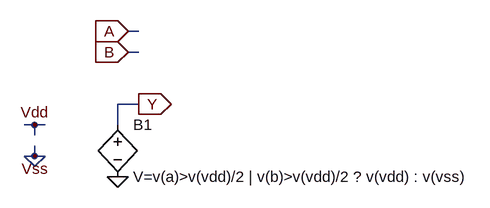
[diagram p0: schematic or.asc]
or.asc, the LTspice schematic file:
Version 4
SHEET 1 1284 680
WIRE 656 0 640 0
WIRE 656 32 640 32
WIRE 656 112 624 112
WIRE 496 144 480 144
WIRE 512 144 496 144
WIRE 624 144 624 112
WIRE 496 160 496 144
WIRE 496 192 496 176
WIRE 496 192 480 192
WIRE 512 192 496 192
WIRE 496 208 480 192
WIRE 496 208 512 192
FLAG 656 112 Y
IOPIN 656 112 Out
FLAG 624 224 0
FLAG 640 0 A
IOPIN 640 0 In
FLAG 640 32 B
IOPIN 640 32 In
FLAG 496 144 Vdd
FLAG 496 192 Vss
SYMBOL bv 624 128 R0
SYMATTR InstName B1
SYMATTR Value V=v(a)>v(vdd)/2 | v(b)>v(vdd)/2 ? v(vdd) : v(vss)

The netlist it stands for:
* or.asc
B1 Y 0 V=v(a)>v(vdd)/2 | v(b)>v(vdd)/2 ? v(vdd) : v(vss)
.backanno
.end